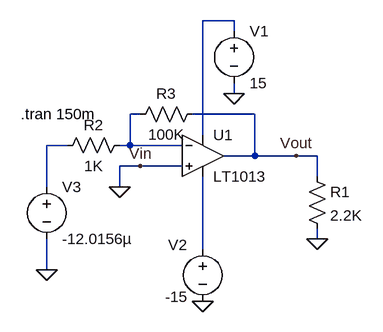
[diagram p0: schematic Opamp Input Offset.asc]
Opamp Input Offset.asc, the LTspice schematic file:
Version 4
SHEET 1 880 680
WIRE 288 -64 240 -64
WIRE 288 -48 288 -64
WIRE 288 48 288 32
WIRE 144 80 128 80
WIRE 320 80 224 80
WIRE 240 112 240 -64
WIRE 32 128 0 128
WIRE 128 128 128 80
WIRE 128 128 112 128
WIRE 208 128 128 128
WIRE 320 144 320 80
WIRE 320 144 272 144
WIRE 384 144 320 144
WIRE 416 144 384 144
WIRE 144 160 112 160
WIRE 208 160 144 160
WIRE 416 176 416 144
WIRE 0 192 0 128
WIRE 112 192 112 160
WIRE 416 272 416 256
WIRE 240 288 240 176
WIRE 0 320 0 272
FLAG 288 48 0
FLAG 240 368 0
FLAG 384 144 Vout
FLAG 416 272 0
FLAG 0 320 0
FLAG 112 192 0
FLAG 144 160 Vin
SYMBOL Opamps\\LT1013 240 80 R0
SYMATTR InstName U1
SYMBOL voltage 288 -64 R0
WINDOW 123 0 0 Left 2
WINDOW 39 0 0 Left 2
SYMATTR InstName V1
SYMATTR Value 15
SYMBOL res 400 160 R0
SYMATTR InstName R1
SYMATTR Value 2.2K
SYMBOL voltage 240 272 R0
WINDOW 0 -53 9 Left 2
WINDOW 3 -58 89 Left 2
WINDOW 123 0 0 Left 2
WINDOW 39 0 0 Left 2
SYMATTR InstName V2
SYMATTR Value -15
SYMBOL res 128 112 R90
WINDOW 0 0 56 VBottom 2
WINDOW 3 32 56 VTop 2
SYMATTR InstName R2
SYMATTR Value 1K
SYMBOL res 240 64 R90
WINDOW 0 0 56 VBottom 2
WINDOW 3 32 56 VTop 2
SYMATTR InstName R3
SYMATTR Value 100K
SYMBOL voltage 0 176 R0
WINDOW 123 0 0 Left 2
WINDOW 39 0 0 Left 2
SYMATTR InstName V3
SYMATTR Value -12.0156µ
TEXT -40 80 Left 2 !.tran 150m

The netlist it stands for:
* Opamp Input Offset.asc
XU1 0 N002 N001 N004 Vout LT1013  ; pins In+ In- V+ V- OUT
V1 N001 0 15
R1 Vout 0 2.2K
V2 N004 0 -15
R2 N002 N003 1K
R3 Vout N002 100K
V3 N003 0 -12.0156µ
.tran 150m
.lib LTC.lib
.backanno
.end